# Altium project PCB_Project_1.PrjPcb
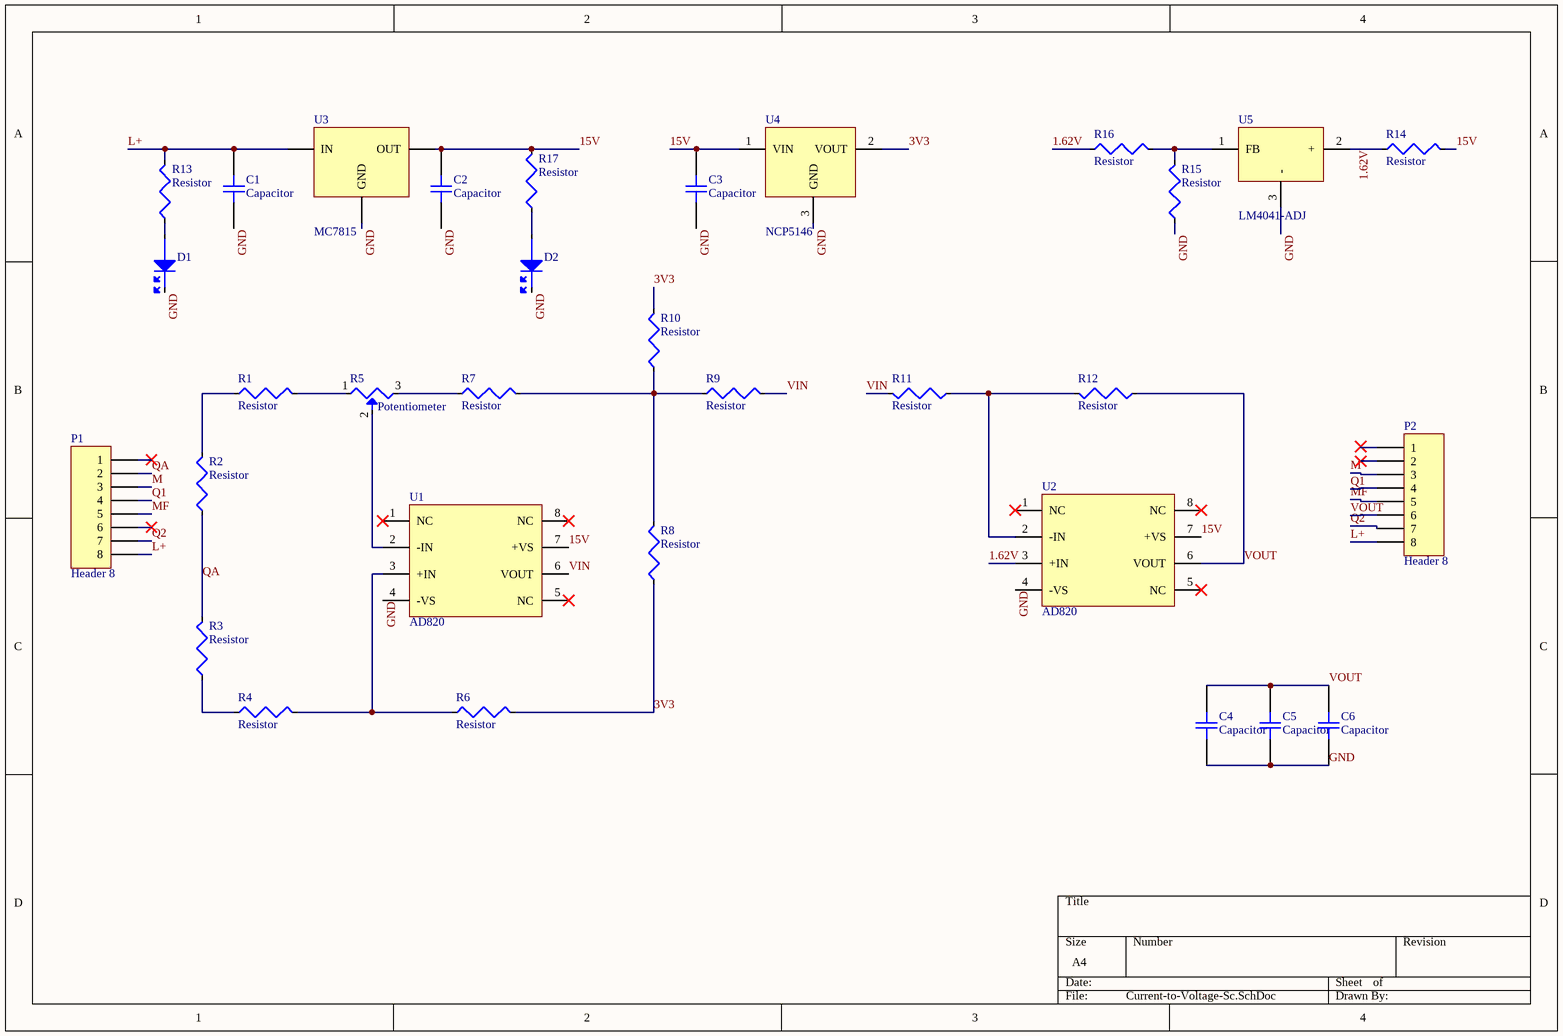
[diagram p0: Current-to-Voltage-Sc.SchDoc]
1 sheet, 32 parts. Net scope: global (net labels, ports and power ports of the same name join across sheets).
Board file: Current-to-Voltage.PcbDoc

## Sheet Current-to-Voltage-Sc.SchDoc
size A4

### Parts
C1  Capacitor  [C0805]
C2  Capacitor  [C0805]
C3  Capacitor  [C0805]
C4  Capacitor  [C0805]
C5  Capacitor  [C0805]
C6  Capacitor  [C0805]
D1  LED  [LED0805]  (value not drawn)
D2  LED  [LED0805]  (value not drawn)
P1  Header 8  [HDR1X8]
P2  Header 8  [HDR1X8]
R1  Resistor  [R0805 - duplicate2]
R2  Resistor  [R0805 - duplicate2]
R3  Resistor  [R0805 - duplicate2]
R4  Resistor  [R0805 - duplicate2]
R5  Potentiometer  [POT3]
R6  Resistor  [R0805 - duplicate2]
R7  Resistor  [R0805 - duplicate2]
R8  Resistor  [R0805 - duplicate2]
R9  Resistor  [R0805 - duplicate2]
R10  Resistor  [R0805 - duplicate2]
R11  Resistor  [R0805 - duplicate2]
R12  Resistor  [R0805 - duplicate2]
R13  Resistor  [R0805 - duplicate2]
R14  Resistor  [R0805 - duplicate2]
R15  Resistor  [R1206]
R16  Resistor  [R0805 - duplicate2]
R17  Resistor  [R0805 - duplicate2]
U1  AD820  [SOIC127P600X175-8N]
U2  AD820  [SOIC127P600X175-8N]
U3  MC7815  [DPAK229P991X238-3N]
U4  NCP5146  [SOT95P237X110-3N]
U5  LM4041-ADJ  [SOT95P237X110-3N]

### Nets
1.62V: R14.1 R16.1 U2.3(+IN) U5.2(+)
3V3: R6.2 R8.1 R10.2 U4.2(VOUT)
15V: C2.2 C3.2 R14.2 R17.2 U1.7(+VS) U2.7(+VS) U3.3(OUT) U4.1(VIN)
GND: C1.1 C2.1 C3.1 C4.1 C5.1 C6.1 D1.1 D2.1 R15.1 U1.4(-VS) U2.4(-VS) U3.2(GND) U4.3(GND) U5.3(-)
L+: C1.2 P1.8 P2.8 R13.2 U3.1(IN)
M: P1.3 P2.3
MF: P1.5 P2.5
Q1: P1.4 P2.4
Q2: P1.7 P2.7
QA: P1.2 R2.1 R3.2
VIN: R9.2 R11.2 U1.6(VOUT)
VOUT: C4.2 C5.2 C6.2 P2.6 R12.1 U2.6(VOUT)
NetD1_2: D1.2 R13.1
NetD2_2: D2.2 R17.1
NetR1_1: R1.1 R2.2
NetR1_2: R1.2 R5.1
NetR3_1: R3.1 R4.1
NetR4_2: R4.2 R6.1 U1.3(+IN)
NetR5_2: R5.2 U1.2(-IN)
NetR5_3: R5.3 R7.1
NetR7_2: R7.2 R8.2 R9.1 R10.1
NetR11_1: R11.1 R12.2 U2.2(-IN)
NetR15_2: R15.2 R16.2 U5.1(FB)

Not connected (* = marked no-connect by the designer): P1 1* 6*; P2 1* 2*; U1 1(NC)* 5(NC)* 8(NC)*; U2 1(NC)* 5(NC)* 8(NC)*

### Library data of the parts
C4 = Capacitor: Value: 1uF
C5 = Capacitor: Value: 100nF; Parameter 1: *
C6 = Capacitor: Value: 10nF
P1 P2 = Header 8: Header, 8-Pin; LatestRevisionDate: 17-Jul-2002; LatestRevisionNote: Re-released for DXP Platform.; Publisher: Altium Limited